# EAGLE design palmquad_v1 (EAGLE 5.11)

## Sheet 1 of 2
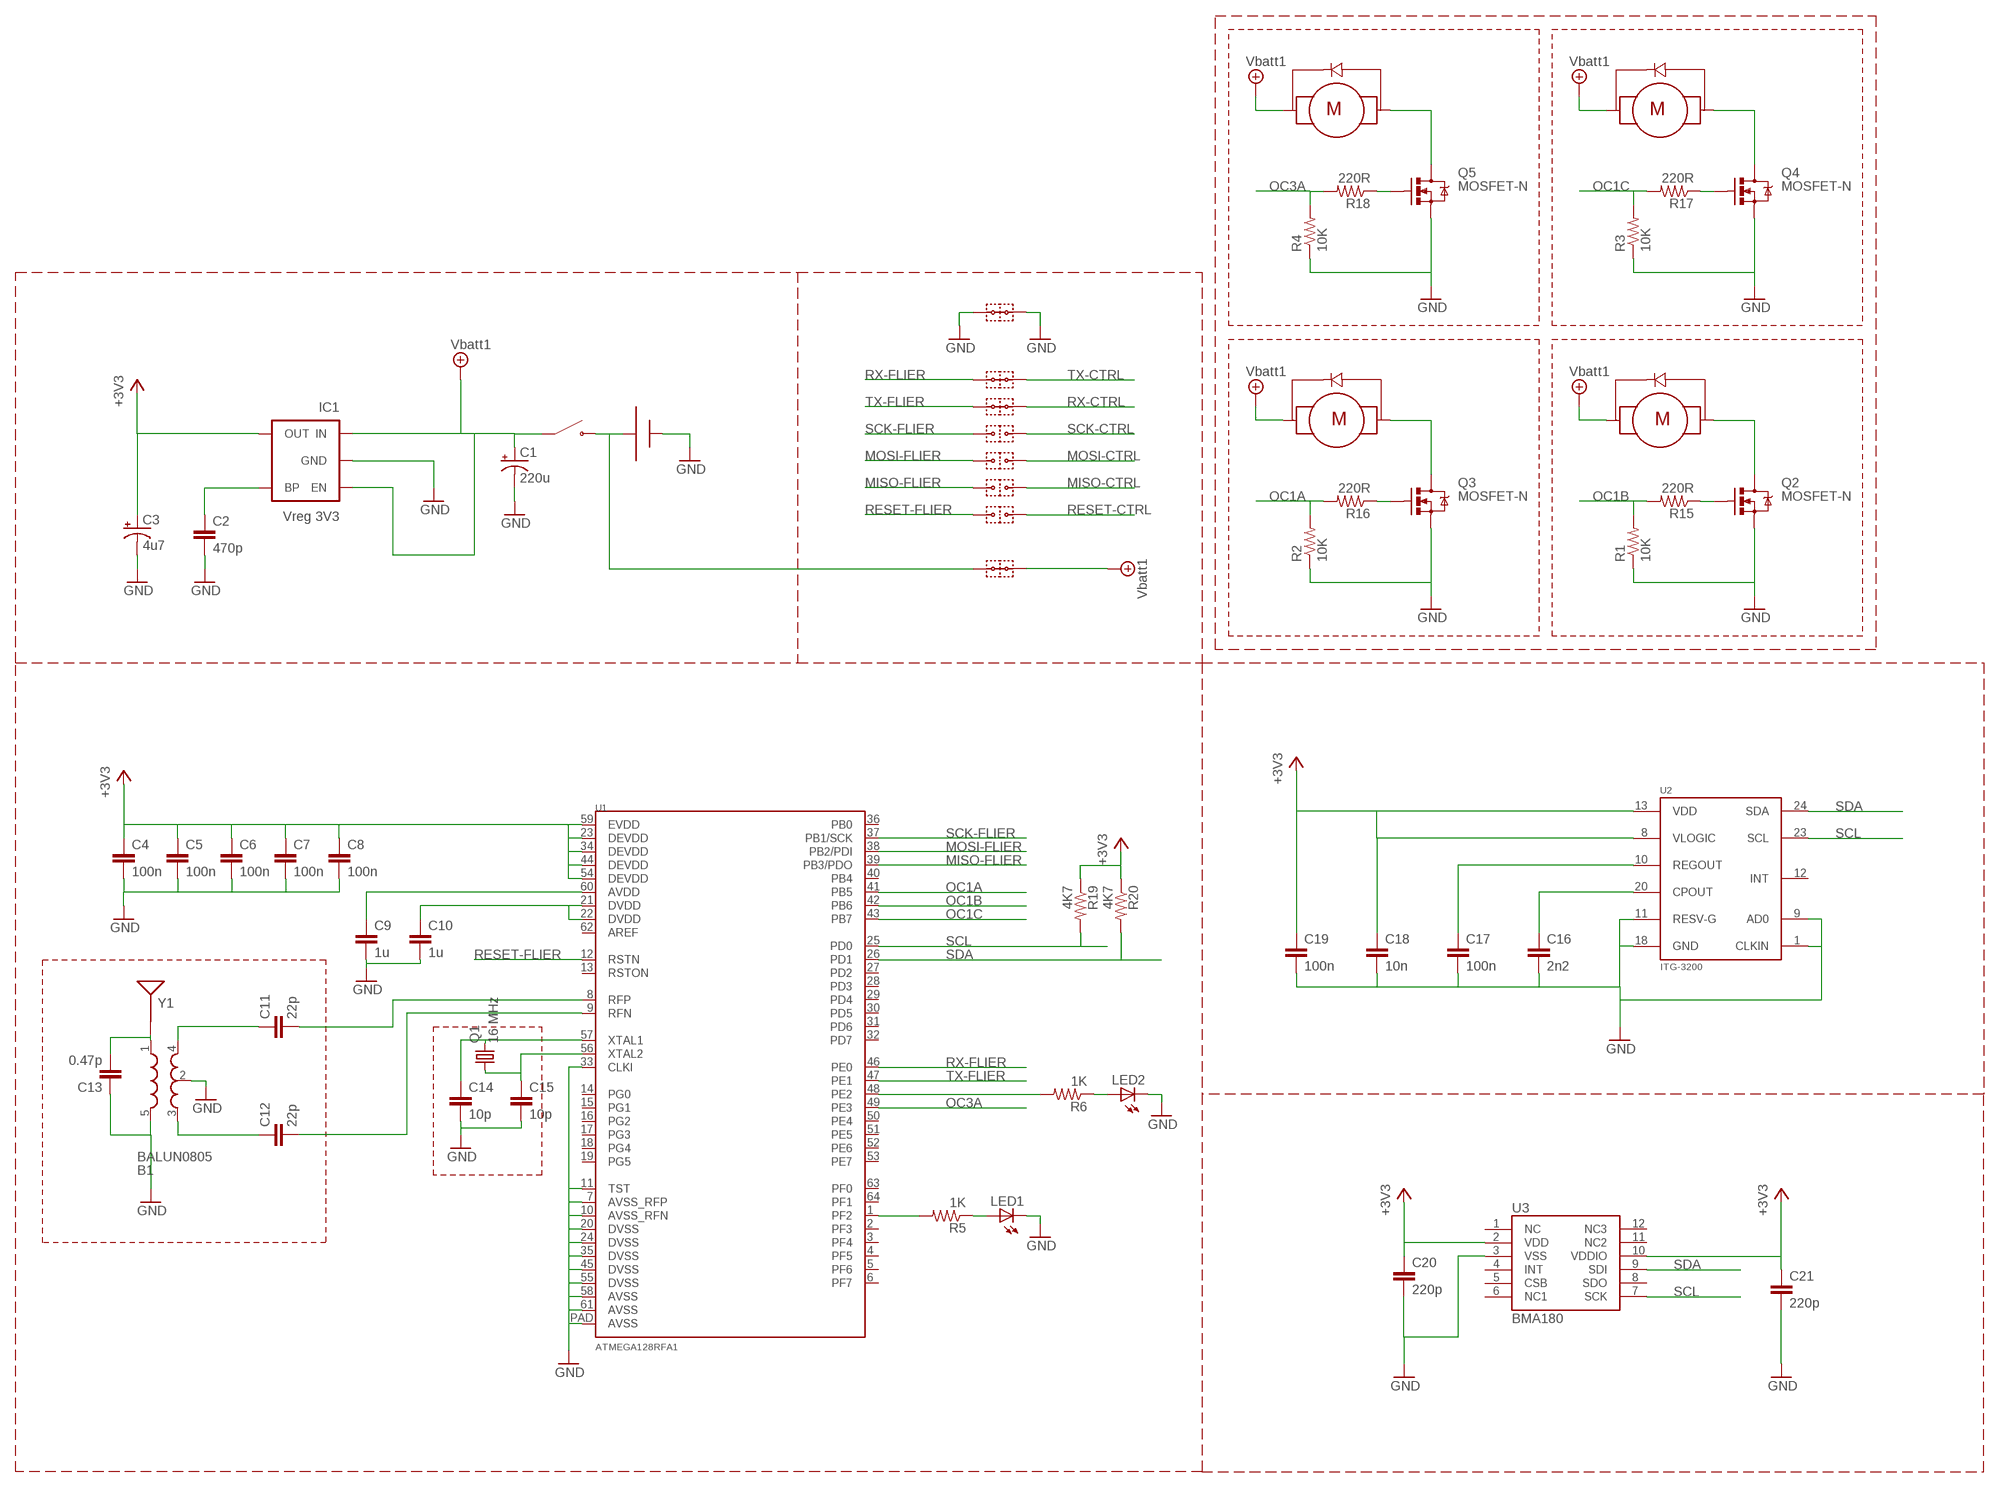
[diagram p0: schematic, sheet 1]

### Parts
B1  BALUN0805  [BALUN]
BATT1  BATT-CONN1  [BATT-CONN-1]
C1  220u  CPOL-USD  [PANASONIC_D]
C2  470p  C-EUC0603  [C0603]
C3  4u7  CPOL-USSMCA  [SMC_A]
C4  100n  C-EUC0603  [C0603]
C5  100n  C-EUC0603  [C0603]
C6  100n  C-EUC0603  [C0603]
C7  100n  C-EUC0603  [C0603]
C8  100n  C-EUC0603  [C0603]
C9  1u  C-EUC0603  [C0603]
C10  1u  C-EUC0603  [C0603]
C11  22p  C-EUC0603  [C0603]
C12  22p  C-EUC0603  [C0603]
C13  0.47p  C-EUC0603  [C0603]
C14  10p  C-EUC0603  [C0603]
C15  10p  C-EUC0603  [C0603]
C16  2n2  C-EUC0603  [C0603]
C17  100n  C-EUC0603  [C0603]
C18  10n  C-EUC0603  [C0603]
C19  100n  C-EUC0603  [C0603]
C20  220p  C-EUC0603  [C0603]
C21  220p  C-EUC0603  [C0603]
IC1  Vreg 3V3  V_REG_LDOSMD  [SOT23-5]
LED1  LEDCHIPLED_0603  [CHIPLED_0603]
LED2  LEDCHIPLED_0603  [CHIPLED_0603]
M1  MOTORARM-CORNER  [MOTOR-CORNER-2]
M2  MOTORARM-CORNER  [MOTOR-CORNER-2]
M3  MOTORARM-CORNER  [MOTOR-CORNER-2]
M4  MOTORARM-CORNER  [MOTOR-CORNER-2]
Q1  16 MHz  CRYSTALCTS406  [CTS406]
Q2  MOSFET-N  MOSFET-NCHANNELSMD  [SOT23-3]
Q3  MOSFET-N  MOSFET-NCHANNELSMD  [SOT23-3]
Q4  MOSFET-N  MOSFET-NCHANNELSMD  [SOT23-3]
Q5  MOSFET-N  MOSFET-NCHANNELSMD  [SOT23-3]
R1  10K  R-US_R0603  [R0603]
R2  10K  R-US_R0603  [R0603]
R3  10K  R-US_R0603  [R0603]
R4  10K  R-US_R0603  [R0603]
R5  1K  R-US_R0603  [R0603]
R6  1K  R-US_R0603  [R0603]
R15  220R  R-US_R0603  [R0603]
R16  220R  R-US_R0603  [R0603]
R17  220R  R-US_R0603  [R0603]
R18  220R  R-US_R0603  [R0603]
R19  4K7  R-US_R0603  [R0603]
R20  4K7  R-US_R0603  [R0603]
S2  SWITCH-PWR-SIMPLE  [SWITCH-PWR]
U1  ATMEGA128RFA1  [QFN-64]
U2  ITG-3200  [QFN-24]
U3  BMA180  [LGA12]
U$1  EDGE-CONN-O-1  [EDGE-CONN-O]
U$2  EDGE-CONN-O-1  [EDGE-CONN-O]
U$3  EDGE-CONN-O-1  [EDGE-CONN-O]
U$4  EDGE-CONN-O-1  [EDGE-CONN-O]
X1  EDGE-CONN-C-1  [EDGE-CONN-C]
X2  EDGE-CONN-C-1  [EDGE-CONN-C]
X5  EDGE-CONN-C-1  [EDGE-CONN-C]
X6  EDGE-CONN-C-1  [EDGE-CONN-C]
Y1  ANTENNA2COMBO1  [ANTENNA-COMBO1]

### Nets
+3V3_FLIER: C3.+ C4.1 C5.1 C6.1 C7.1 C8.1 C18.1 C19.1 C20.1 C21.1 IC1.5(OUT) R19.1 R20.1 U1.23(DEVDD) U1.34(DEVDD) U1.44(DEVDD) U1.54(DEVDD) U1.59(EVDD) U2.8(VLOGIC) U2.13(VDD) U3.2(VDD) U3.10(VDDIO) ; supply symbol labelled +3V3
GND: B1.2(GND) B1.5(GND) BATT1.2 C1.- C2.2 C3.- C4.2 C5.2 C6.2 C7.2 C8.2 C9.2 C10.2 C13.1 C14.2 C15.2 C16.2 C17.2 C18.2 C19.2 C20.2 C21.2 IC1.2(GND) LED1.C LED2.C Q2.2(S) Q3.2(S) Q4.2(S) Q5.2(S) R1.1 R2.1 R3.1 R4.1 U1.7(AVSS_RFP) U1.10(AVSS_RFN) U1.11(TST) U1.20(DVSS) U1.24(DVSS) U1.33(CLKI) U1.35(DVSS) U1.45(DVSS) U1.55(DVSS) U1.58(AVSS) U1.61(AVSS) U1.PAD(AVSS) U2.1(CLKIN) U2.9(AD0) U2.11(RESV-G) U2.18(GND) U3.3(VSS) X6.1 X6.2 ; also sheet 2
MISO-CTRL: U$3.2 ; also sheet 2
MISO-FLIER: U1.39(PB3/PDO) U$3.1
MOSI-CTRL: U$2.2 ; also sheet 2
MOSI-FLIER: U1.38(PB2/PDI) U$2.1
MS1: B1.1(IN) C13.2 Y1.ANT(SIGNAL)
N$1: C2.1 IC1.4(BP)
N$3: C11.2 U1.8(RFP)
N$4: C10.1 U1.21(DVDD) U1.22(DVDD)
N$5: C9.1 U1.60(AVDD)
N$6: B1.3(OUT1) C12.1
N$7: B1.4(OUT2) C11.1
N$8: C12.2 U1.9(RFN)
N$9: C14.1 Q1.3 U1.57(XTAL1)
N$10: C15.1 Q1.1 U1.56(XTAL2)
N$16: C16.1 U2.20(CPOUT)
N$17: C17.1 U2.10(REGOUT)
N$18: M2.B@1 Q3.3(D)
N$19: M3.A@1 Q4.3(D)
N$20: M4.A@1 Q5.3(D)
N$21: M1.B@1 Q2.3(D)
N$23: R5.2 U1.1(PF2)
N$24: LED1.A R5.1
N$40: BATT1.1 S2.P$2 X5.1
N$43: R6.2 U1.48(PE2)
N$44: LED2.A R6.1
N$45: Q5.1(G) R18.1
N$46: Q4.1(G) R17.1
N$47: Q2.1(G) R15.1
N$48: Q3.1(G) R16.1
OC1A: R2.2 R16.2 U1.41(PB5)
OC1B: R1.2 R15.2 U1.42(PB6)
OC1C: R3.2 R17.2 U1.43(PB7)
OC3A: R4.2 R18.2 U1.49(PE3)
RESET-CTRL: U$4.2 ; also sheet 2
RESET-FLIER: U1.12(RSTN) U$4.1
RX-CTRL: X2.2 ; also sheet 2
RX-FLIER: U1.46(PE0) X1.1
SCK-CTRL: U$1.2 ; also sheet 2
SCK-FLIER: U1.37(PB1/SCK) U$1.1
SCL: R19.2 U1.25(PD0) U2.23(SCL) U3.7(SCK)
SDA: R20.2 U1.26(PD1) U2.24(SDA) U3.9(SDI)
TX-CTRL: X1.2 ; also sheet 2
TX-FLIER: U1.47(PE1) X2.1
VBATT-FLIER: C1.+ IC1.1(IN) IC1.3(EN) M1.A@1 M2.A@1 M3.B@1 M4.B@1 S2.P$1 ; supply symbol labelled Vbatt1
VBATT_CHG: X5.2 ; supply symbol labelled Vbatt1 ; also sheet 2
Unconnected: U1.2(PF3) U1.3(PF4) U1.4(PF5) U1.5(PF6) U1.6(PF7) U1.13(RSTON) U1.14(PG0) U1.15(PG1) U1.16(PG2) U1.17(PG3) U1.18(PG4) U1.19(PG5) U1.27(PD2) U1.28(PD3) U1.29(PD4) U1.30(PD5) U1.31(PD6) U1.32(PD7) U1.36(PB0) U1.40(PB4) U1.50(PE4) U1.51(PE5) U1.52(PE6) U1.53(PE7) U1.62(AREF) U1.63(PF0) U1.64(PF1) U2.12(INT) U3.1(NC) U3.4(INT) U3.5(CSB) U3.6(NC1) U3.8(SDO) U3.11(NC2) U3.12(NC3)

## Sheet 2 of 2
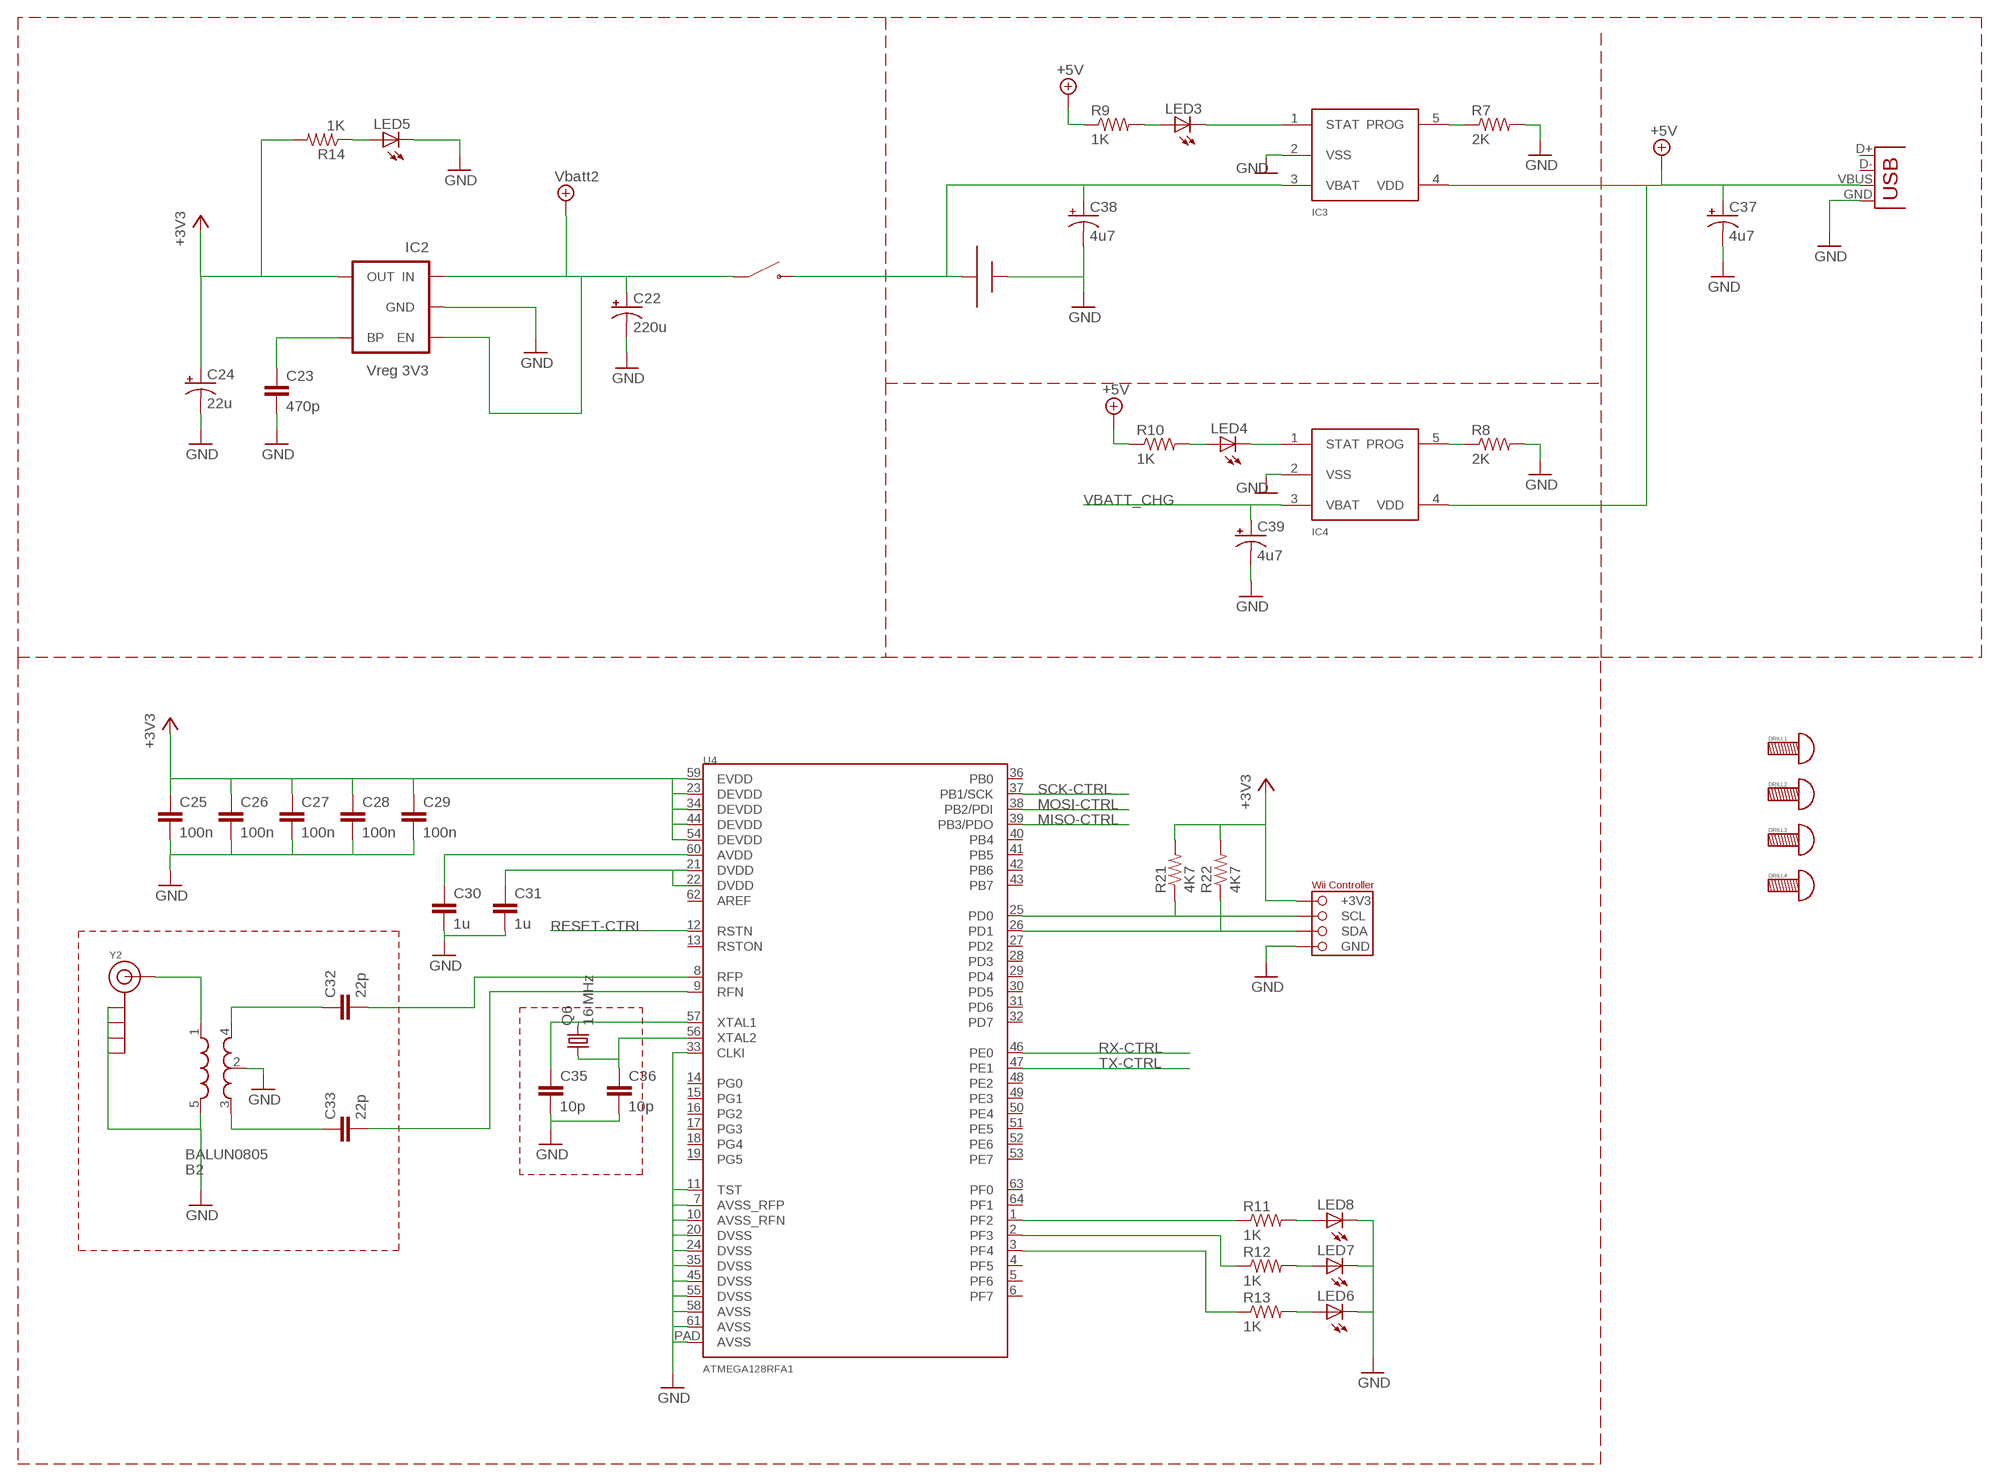
[diagram p1: schematic, sheet 2]

### Parts
B2  BALUN0805  [BALUN]
BATT2  BATT-CONN1  [BATT-CONN-1]
C22  220u  CPOL-USSMCC  [SMC_C]
C23  470p  C-EUC0603  [C0603]
C24  22u  CPOL-USSMCB  [SMC_B]
C25  100n  C-EUC0603  [C0603]
C26  100n  C-EUC0603  [C0603]
C27  100n  C-EUC0603  [C0603]
C28  100n  C-EUC0603  [C0603]
C29  100n  C-EUC0603  [C0603]
C30  1u  C-EUC0603  [C0603]
C31  1u  C-EUC0603  [C0603]
C32  22p  C-EUC0603  [C0603]
C33  22p  C-EUC0603  [C0603]
C35  10p  C-EUC0603  [C0603]
C36  10p  C-EUC0603  [C0603]
C37  4u7  CPOL-USSMCA  [SMC_A]
C38  4u7  CPOL-USSMCA  [SMC_A]
C39  4u7  CPOL-USSMCA  [SMC_A]
DRILL1  HOLE-4-40  [HOLE-4-40]
DRILL2  HOLE-4-40  [HOLE-4-40]
DRILL3  HOLE-4-40  [HOLE-4-40]
DRILL4  HOLE-4-40  [HOLE-4-40]
IC2  Vreg 3V3  V_REG_LDOSMD  [SOT23-5]
IC3  MCP-LI-CHARGER-1  [SOT23-5]
IC4  MCP-LI-CHARGER-1  [SOT23-5]
LED3  LEDCHIPLED_0603  [CHIPLED_0603]
LED4  LEDCHIPLED_0603  [CHIPLED_0603]
LED5  LEDCHIPLED_0603  [CHIPLED_0603]
LED6  LEDCHIPLED_0603  [CHIPLED_0603]
LED7  LEDCHIPLED_0603  [CHIPLED_0603]
LED8  LEDCHIPLED_0603  [CHIPLED_0603]
Q6  16 MHz  CRYSTALCTS406  [CTS406]
R7  2K  R-US_R0603  [R0603]
R8  2K  R-US_R0603  [R0603]
R9  1K  R-US_R0603  [R0603]
R10  1K  R-US_R0603  [R0603]
R11  1K  R-US_R0603  [R0603]
R12  1K  R-US_R0603  [R0603]
R13  1K  R-US_R0603  [R0603]
R14  1K  R-US_R0603  [R0603]
R21  4K7  R-US_R0603  [R0603]
R22  4K7  R-US_R0603  [R0603]
S1  SWITCH-PWR-CNKOS2  [SWITCH-SPDT-CNK-OS2]
U4  ATMEGA128RFA1  [QFN-64]
USB  USBSMD  [USB-MINIB]
X11  WII-CONN  [WII-CONN-2]
Y2  SMA_EDGE  [SMA-EDGE]

### Nets
+3V3_CTRL: C24.+ C25.1 C26.1 C27.1 C28.1 C29.1 IC2.5(OUT) R14.2 R21.2 R22.2 U4.23(DEVDD) U4.34(DEVDD) U4.44(DEVDD) U4.54(DEVDD) U4.59(EVDD) X11.+3V3 ; supply symbol labelled +3V3
GND: B2.2(GND) B2.5(GND) BATT2.2 C22.- C23.2 C24.- C25.2 C26.2 C27.2 C28.2 C29.2 C30.2 C31.2 C35.2 C36.2 C37.- C38.- C39.- IC2.2(GND) IC3.2(VSS) IC4.2(VSS) LED5.C LED6.C LED7.C LED8.C R7.2 R8.2 U4.7(AVSS_RFP) U4.10(AVSS_RFN) U4.11(TST) U4.20(DVSS) U4.24(DVSS) U4.33(CLKI) U4.35(DVSS) U4.45(DVSS) U4.55(DVSS) U4.58(AVSS) U4.61(AVSS) U4.PAD(AVSS) USB.GND X11.GND Y2.GND@0(GND) Y2.GND@1(GND) Y2.GND@2(GND) Y2.GND@3(GND) ; also sheet 1
MISO-CTRL: U4.39(PB3/PDO) ; also sheet 1
MOSI-CTRL: U4.38(PB2/PDI) ; also sheet 1
N$2: LED5.A R14.1
N$11: IC3.5(PROG) R7.1
N$12: LED6.A R13.2
N$13: LED7.A R12.2
N$14: LED8.A R11.2
N$15: IC4.5(PROG) R8.1
N$22: R11.1 U4.1(PF2)
N$25: C23.1 IC2.4(BP)
N$26: C31.1 U4.21(DVDD) U4.22(DVDD)
N$27: C30.1 U4.60(AVDD)
N$28: B2.1(IN) Y2.SIG(SIGNAL)
N$29: B2.3(OUT1) C33.1
N$30: B2.4(OUT2) C32.1
N$31: C32.2 U4.8(RFP)
N$32: C33.2 U4.9(RFN)
N$33: C35.1 Q6.3 U4.57(XTAL1)
N$34: C36.1 Q6.1 U4.56(XTAL2)
N$35: LED3.A R9.2
N$36: IC3.1(STAT) LED3.C
N$37: LED4.A R10.2
N$38: IC4.1(STAT) LED4.C
N$39: BATT2.1 C38.+ IC3.3(VBAT) S1.2
N$41: R12.1 U4.2(PF3)
N$42: R13.1 U4.3(PF4)
RESET-CTRL: U4.12(RSTN) ; also sheet 1
RX-CTRL: U4.46(PE0) ; also sheet 1
SCK-CTRL: U4.37(PB1/SCK) ; also sheet 1
SCL-2: R21.1 U4.25(PD0) X11.SCL
SDA-2: R22.1 U4.26(PD1) X11.SDA
TX-CTRL: U4.47(PE1) ; also sheet 1
VBATT-CTRL: C22.+ IC2.1(IN) IC2.3(EN) S1.1 ; supply symbol labelled Vbatt2
VBATT_CHG: C39.+ IC4.3(VBAT) ; also sheet 1
VUSB: C37.+ IC3.4(VDD) IC4.4(VDD) R9.1 R10.1 USB.VBUS ; supply symbol labelled +5V
Unconnected: U4.4(PF5) U4.5(PF6) U4.6(PF7) U4.13(RSTON) U4.14(PG0) U4.15(PG1) U4.16(PG2) U4.17(PG3) U4.18(PG4) U4.19(PG5) U4.27(PD2) U4.28(PD3) U4.29(PD4) U4.30(PD5) U4.31(PD6) U4.32(PD7) U4.36(PB0) U4.40(PB4) U4.41(PB5) U4.42(PB6) U4.43(PB7) U4.48(PE2) U4.49(PE3) U4.50(PE4) U4.51(PE5) U4.52(PE6) U4.53(PE7) U4.62(AREF) U4.63(PF0) U4.64(PF1) USB.D+ USB.D-

## Library data of the parts
B1 B2 = palmquad_alpha:BALUN
BATT1 BATT2 = palmquad_alpha:BATT-CONN
C1 C3 C22 C24 C37-C39 = rcl:CPOL-US: POLARIZED CAPACITOR, American symbol
C2 C4-C21 C23 C25-C33 C35 C36 = rcl:C-EU: CAPACITOR, European symbol
DRILL1-DRILL4 = palmquad_alpha:HOLE
IC1 IC2 = palmquad_alpha:V_REG_LDO: Voltage Regulator LDO Standard 150mA LDO voltage regulator in SOT-23 layout. Micrel part MIC5205. BP (by-pass) pin is used to lower output noise with 470pF cap.
IC3 IC4 = palmquad_alpha:MCP-LI-CHARGER-1
LED1-LED8 = led:LED: LED OSRAM: - CHIPLED LG R971, LG N971, LY N971, LG Q971, LY Q971, LO R971, LY R971 LH N974, LH R974 LS Q976, LO Q976, LY Q976 LO Q996 - Hyper CHIPLED LW Q18S LB Q993, LB Q99A, LB R99A - SideLED LS A670, LO A670, LY A670, LG A670, LP A670 LB A673, LV A673, LT A673, LW A673 LH A674 LY A675 LS A676, LA A676, LO A676, LY A676, LW A676 LS A679, LY A679, LG A679 - Hyper Micro SIDELED® LS Y876, LA Y876, LO Y876, LY Y876 LT Y87S - SmartLED LW L88C, LW L88S LB L89C, LB L89S, LG L890 LS L89K, LO L89K, LY L89K LS L896, LA L896, LO L896, LY L896 - TOPLED LS T670, LO T670, LY T670, LG T670, LP T670 LSG T670, LSP T670, LSY T670, LOP T670, LYG T670 LG T671, LOG T671, LSG T671 LB T673, LV T673, LT T673, LW T673 LH T674 LS T676, LA T676, LO T676, LY T676, LB T676, LH T676, LSB T676, LW T676 LB T67C, LV T67C, LT T67C, LS T67K, LO T67K, LY T67K, LW E67C LS E67B, LA E67B, LO E67B, LY E67B, LB E67C, LV E67C, LT E67C LW T67C LS T679, LY T679, LG T679 LS T770, LO T770, LY T770, LG T770, LP T770 LB T773, LV T773, LT T773, LW T773 LH T774 LS E675, LA E675, LY E675, LS T675 LS T776, LA T776, LO T776, LY T776, LB T776 LHGB T686 LT T68C, LB T68C - Hyper Mini TOPLED® LB M676 - Mini TOPLED Santana® LG M470 LS M47K, LO M47K, LY M47K Source: http://www.osram.convergy.de LUXEON: - LUMILED® LXK2-PW12-R00, LXK2-PW12-S00, LXK2-PW14-U00, LXK2-PW14-V00 LXK2-PM12-R00, LXK2-PM12-S00, LXK2-PM14-U00 LXK2-PE12-Q00, LXK2-PE12-R00, LXK2-PE12-S00, LXK2-PE14-T00, LXK2-PE14-U00 LXK2-PB12-K00, LXK2-PB12-L00, LXK2-PB12-M00, LXK2-PB14-N00, LXK2-PB14-P00, LXK2-PB14-Q00 LXK2-PR12-L00, LXK2-PR12-M00, LXK2-PR14-Q00, LXK2-PR14-R00 LXK2-PD12-Q00, LXK2-PD12-R00, LXK2-PD12-S00 LXK2-PH12-R00, LXK2-PH12-S00 LXK2-PL12-P00, LXK2-PL12-Q00, LXK2-PL12-R00 Source: www.luxeon.com KINGBRIGHT: KA-3528ASYC Source: www.kingbright.com
M1-M4 = palmquad_alpha:MOTOR
Q1 Q6 = crystal:CRYSTAL: CRYSTAL
Q2-Q5 = palmquad_alpha:MOSFET-NCHANNEL
R1-R22 = rcl:R-US_: RESISTOR, American symbol
S1 S2 = palmquad_alpha:SWITCH-PWR
U1 U4 = palmquad_alpha:ATMEGA128RFA1
U2 = palmquad_alpha:ITG-3200: ITG-3200 3-axis gyro, digital output, qfn24 package
U3 = palmquad_alpha:BMA180
U$1-U$4 = palmquad_alpha:EDGE-CONN-O
USB = palmquad_alpha:USB: USB Connectors USB-B-PTH is fully proven SKU : PRT-00139 USB-miniB is fully proven SKU : PRT-00587 USB-A-PCB is untested. USB-A-H is throughly reviewed, but untested. Spark Fun Electronics SKU : PRT-00437 USB-B-SMT is throughly reviewed, but untested. Needs silkscreen touching up. USB-A-S has not been used/tested USB-MB-H has not been used/tested
X1 X2 X5 X6 = palmquad_alpha:EDGE-CONN-C
X11 = palmquad_alpha:WII-CONN
Y1 = palmquad_alpha:ANTENNA2: Antenna Single endded antenna. Common with smaller chip antennas. CHIP4 package is the GPS Chip Antenna SKU: GPS-08418. CHIP5 package is 2.4GHz chip antenna SKU: WRL-00144.
Y2 = palmquad_alpha:SMA_EDGE: SMA Antenna Connector End launch SMA connector. The paste layer has been removed so that the connector can be hand soldered onto the board after reflow.

## Board
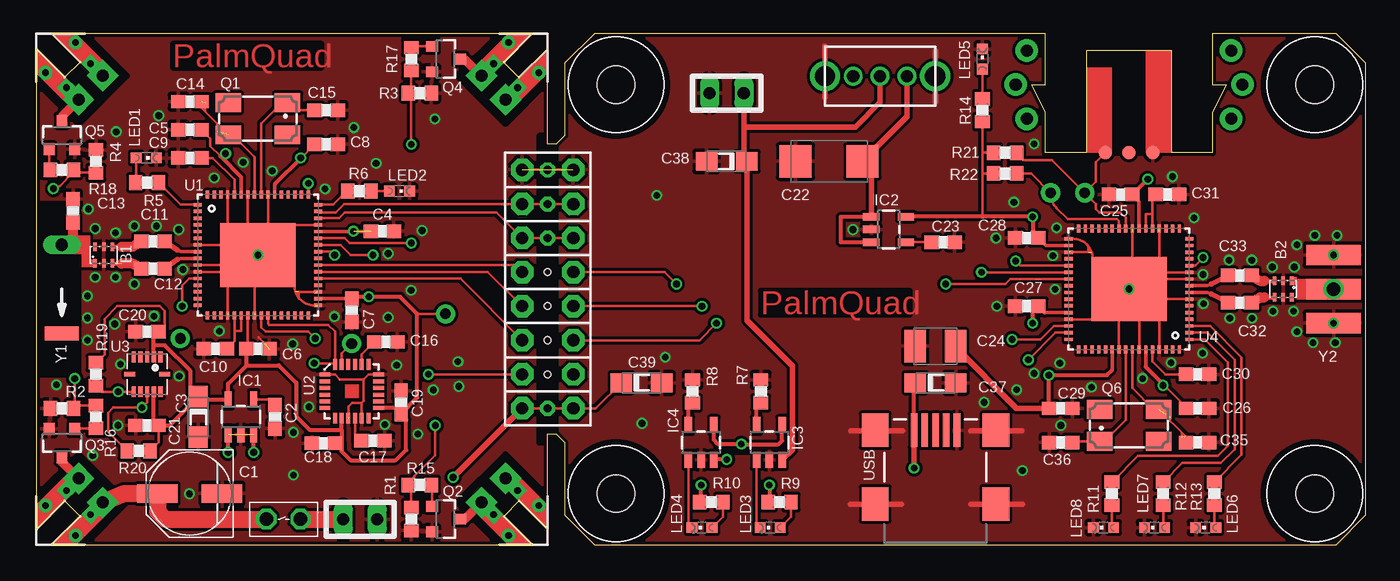
[diagram p2: board, top side]
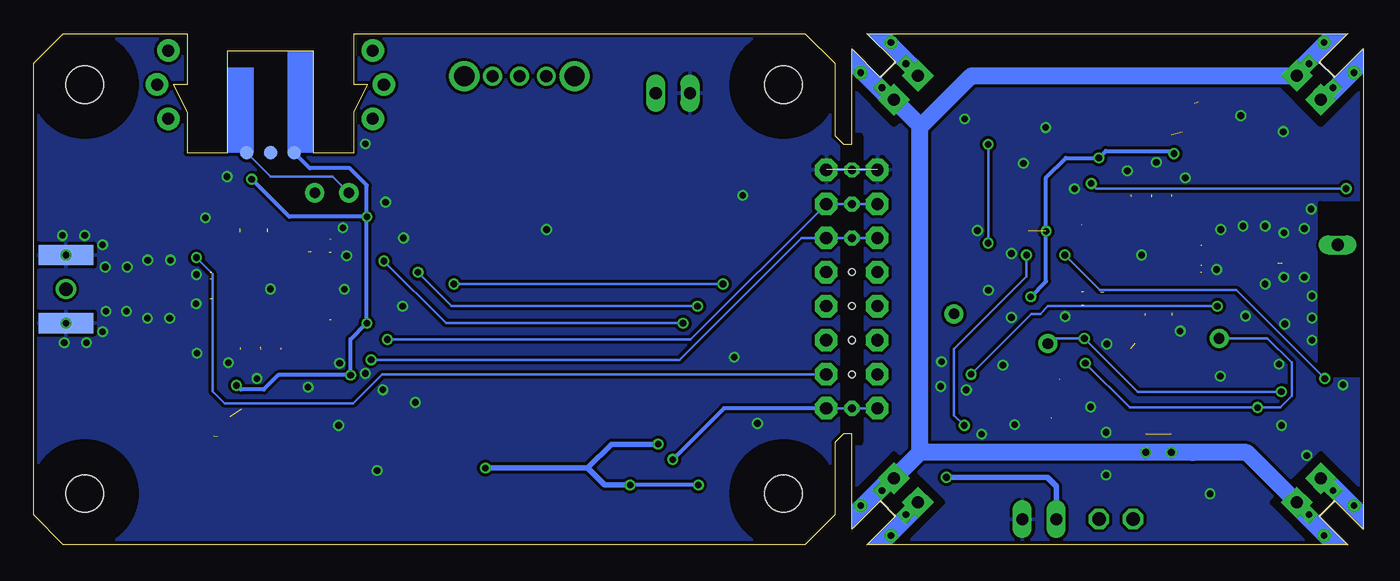
[diagram p3: board, bottom side, seen from below]

Size 99.06 x 38.1 mm. Coordinates in mm from the lower left corner, seen from the top.
Outline: 0,1.14 2.13,3.27 3.27,2.13 1.14,0 36.96,0 34.83,2.13 35.97,3.27 38.1,1.14 38.1,8.26 38.73,8.26 39.37,7.62 39.37,2.22 41.59,0 96.84,0 99.06,2.22 99.06,35.88 96.84,38.1 87.63,38.1 87.63,34.29 88.65,34.29 87.63,32.26 87.63,29.21 84.58,29.21 84.58,36.83 78.23,36.83 78.23,29.21 75.18,29.21 75.18,32.26 74.17,34.29 75.18,34.29 75.18,38.1 41.59,38.1 39.37,35.88 39.37,30.48 38.73,29.84 38.1,29.84 38.1,36.96 36.01,34.86 35.94,34.86 34.86,35.94 34.86,36.01 36.96,38.1 1.14,38.1 3.27,35.97 2.13,34.83 0,36.96 0,1.14
Copper layers (1*16): Top 0.035mm / dielectric 1.5mm / Bottom 0.035mm
Design rules "Fusion_eagle_rule_v1.1_TentedVias3": minimum track width 6mil, minimum drill 0.3mm, track to track 7mil, track to pad 7mil, pad to pad 7mil, via to via 7mil, smd to smd 0mil, copper to edge 10mil, drill to drill 10mil, minimum pad ring 10mil, minimum via ring 6mil, stop-mask expansion 2mil, vias tented up to drill 25mil, thermal gap 10mil
tRestrict: area 0,12.7 to 3.2,25.4; area 37.5,7.6 to 38.7,30.5; area 12.4,17.4 to 20.6,25.7; area 77.3,14.9 to 85.5,23.2; area 7,12 to 9.5,13.4; area 22,10 to 25,12.9; 4 lines
bRestrict: area 0,12.7 to 3.2,25.4; area 37.5,7.6 to 38.7,30.5

### Footprints (pad centres in the part's own frame; a part is rotated, then mirrored left to right if it is on the bottom)
BALUN = smd 0.27 x 0.635: 1 -0.7,-0.616; 2 -0.05,-0.616; 3 0.6,-0.616; 4 0.6,0.616; 5 -0.05,0.616; 6 -0.7,0.616
BATT-CONN-1 = drill 0.9 long: 1 -1.27,0; 2 1.27,0
PANASONIC_D = smd 3 x 1.4: + 2.4,0; - -2.4,0
C0603 = smd 1.1 x 1: 1 -0.85,0; 2 0.85,0
SMC_A = smd 1.6 x 1.4: + -1.5,0; - 1.5,0
SMC_C = smd 2.4 x 2.4: + -2.5,0; - 2.5,0
SMC_B = smd 1.6 x 2.4: + -1.5,0; - 1.5,0
HOLE-4-40 = hole 2.794: 0,0
SOT23-5 = smd 0.55 x 1.2: 1 -0.95,-1.3; 2 0,-1.3; 3 0.95,-1.3; 4 0.95,1.3; 5 -0.95,1.3
CHIPLED_0603 = smd 0.8 x 0.8: A 0,-0.75; C 0,0.75
MOTOR-CORNER-2 = drill 0.9 pad 1.676 square: A@1 -1.27,-5.715; B@1 1.27,-5.715 | drill 0.5 square: A@2 -1.27,-4.445; B@2 1.27,-4.445 | drill 0.5 round: P$1 -1.587,-2.54; P$2 1.587,-2.54
CTS406 = smd 1.9 x 1.4: 1 -2.2,-1.2; 2 2.2,-1.2; 3 2.2,1.2; 4 -2.2,1.2
SOT23-3 = smd 0.8 x 0.9: 1 -0.95,-1; 2 0.95,-1; 3 0,1.1
R0603 = smd 1 x 1.1: 1 -0.85,0; 2 0.85,0
SWITCH-SPDT-CNK-OS2 = drill 0.9 round: 1 0,2.007; 2 0,0; 3 0,-2.007 | drill 1.499 pad 1.905 round: P$4 0,4.102; P$5 0,-4.102
SWITCH-PWR = drill 1 octagon: P$1 -1.27,0; P$2 1.27,0
QFN-64 = smd 0.6 x 0.25: 1 -4.5,3.75; 2 -4.5,3.25; 3 -4.5,2.75; 4 -4.5,2.25; 5 -4.5,1.75; 6 -4.5,1.25; 7 -4.5,0.75; 8 -4.5,0.25; 9 -4.5,-0.25; 10 -4.5,-0.75; 11 -4.5,-1.25; 12 -4.5,-1.75; 13 -4.5,-2.25; 14 -4.5,-2.75; 15 -4.5,-3.25; 16 -4.5,-3.75; 33 4.5,-3.75; 34 4.5,-3.25; 35 4.5,-2.75; 36 4.5,-2.25; 37 4.5,-1.75; 38 4.5,-1.25; 39 4.5,-0.75; 40 4.5,-0.25; 41 4.5,0.25; 42 4.5,0.75; 43 4.5,1.25; 44 4.5,1.75; 45 4.5,2.25; 46 4.5,2.75; 47 4.5,3.25; 48 4.5,3.75 | smd 0.25 x 0.6: 17 -3.75,-4.5; 18 -3.25,-4.5; 19 -2.75,-4.5; 20 -2.25,-4.5; 21 -1.75,-4.5; 22 -1.25,-4.5; 23 -0.75,-4.5; 24 -0.25,-4.5; 25 0.25,-4.5; 26 0.75,-4.5; 27 1.25,-4.5; 28 1.75,-4.5; 29 2.25,-4.5; 30 2.75,-4.5; 31 3.25,-4.5; 32 3.75,-4.5; 49 3.75,4.5; 50 3.25,4.5; 51 2.75,4.5; 52 2.25,4.5; 53 1.75,4.5; 54 1.25,4.5; 55 0.75,4.5; 56 0.25,4.5; 57 -0.25,4.5; 58 -0.75,4.5; 59 -1.25,4.5; 60 -1.75,4.5; 61 -2.25,4.5; 62 -2.75,4.5; 63 -3.25,4.5; 64 -3.75,4.5 | smd 5.639 x 4.75: PAD 0,0
QFN-24 = smd 0.8 x 0.3: 1 -2,1.25; 2 -2,0.75; 3 -2,0.25; 4 -2,-0.25; 5 -2,-0.75; 6 -2,-1.25; 13 2,-1.25; 14 2,-0.75; 15 2,-0.25; 16 2,0.25; 17 2,0.75; 18 2,1.25 | smd 0.3 x 0.8: 7 -1.25,-2; 8 -0.75,-2; 9 -0.25,-2; 10 0.25,-2; 11 0.75,-2; 12 1.25,-2; 19 1.25,2; 20 0.75,2; 21 0.25,2; 22 -0.25,2; 23 -0.75,2; 24 -1.25,2
LGA12 = smd 0.8 x 0.32: 1 -1.3,1; 2 -1.3,0.5; 3 -1.3,0; 4 -1.3,-0.5; 5 -1.3,-1; 7 1.3,-1; 8 1.3,-0.5; 9 1.3,0; 10 1.3,0.5; 11 1.3,1 | smd 0.32 x 0.8: 6 0,-1.3; 12 0,1.3
EDGE-CONN-O = drill 0.9 pad 1.676 octagon: 1 -1.905,0; 2 1.905,0 | hole 0.5: 0,0
USB-MINIB = smd 2.5 x 0.5: D+ 2.5,0; D- 2.5,0.8; GND 2.5,-1.6; ID 2.5,-0.8; VBUS 2.5,1.6 | smd 2.5 x 2: GND@1 -3,-4.5; GND@2 -3,4.5; GND@3 2.5,4.5; GND@4 2.5,-4.5
EDGE-CONN-C = drill 0.9 pad 1.676 octagon: 1 -1.905,0; 2 1.905,0 | drill 0.6 octagon: C 0,0
WII-CONN-2 = smd 1.016 x 1.016 bottom: +3V3 1.778,7.62; DEV_DET 0,7.62; SDA -1.778,7.62 | smd 1.016 x 1.016: GND -1.778,7.62; NC 0,7.62; SCL 1.778,7.62 | drill 0.9 pad 1.676 round: P$4 -7.62,0; P$5 7.62,0; P$6 -7.62,5.08; P$7 7.62,5.08; P$11 -8.445,2.54; P$12 8.445,2.54
ANTENNA-COMBO1 = drill 0.9 long: ANT 3.302,0 | smd 1.016 x 2.54: NC -3.302,0
SMA-EDGE = smd 1.524 x 4.064: GND@0 0,0; GND@1 5.08,0; SIG 2.54,0 | smd 1.524 x 4.064 bottom: GND@2 0,0; GND@3 5.08,0

### Placement (x,y rotation side)
B1  5.08,21.59 0 top
B2  92.84,19.05 180 top
BATT1  24.13,1.91 0 top
BATT2  51.44,33.66 180 top
C1  11.43,3.81 180 top
C2  17.78,9.53 270 top
C3  12.06,9.53 270 top
C4  25.78,23.37 0 top
C5  11.43,30.92 180 top
C6  16.51,14.61 0 top
C7  23.5,17.46 270 top
C8  21.59,29.84 0 top
C9  11.43,28.83 180 top
C10  13.34,14.61 180 top
C11  8.7,22.61 0 top
C12  8.7,20.57 0 top
C13  2.73,24.89 270 top
C14  11.43,33.02 180 top
C15  21.59,32.38 0 top
C16  26.04,15.11 0 top
C17  25.08,7.75 0 top
C18  21.4,7.56 180 top
C19  27.18,10.6 90 top
C20  8.26,15.88 180 top
C21  8.26,8.89 180 top
C22  59.05,28.57 180 top
C23  67.56,22.55 0 top
C24  66.99,14.8 180 top
C25  80.77,26.1 180 top
C26  86.51,10.16 0 top
C27  73.79,17.78 180 top
C28  73.79,22.86 180 top
C29  76.33,10.16 0 top
C30  86.51,12.7 0 top
C31  84.26,26.1 0 top
C32  89.66,18.03 180 top
C33  89.66,20.07 180 top
C35  86.51,7.62 0 top
C36  76.33,7.62 180 top
C37  66.99,12.06 0 top
C38  51.44,28.57 180 top
C39  45.09,12.06 0 top
DRILL1  43.18,3.81 0 top
DRILL2  95.25,3.81 0 top
DRILL3  43.18,34.29 0 top
DRILL4  95.25,34.29 0 top
IC1  15.24,9.53 0 top
IC2  63.5,23.5 270 top
IC3  54.61,7.62 0 top
IC4  49.53,7.62 0 top
LED1  8.19,28.83 270 top
LED2  27.05,26.35 270 top
LED3  54.67,1.27 90 top
LED4  49.59,1.27 90 top
LED5  70.48,36.2 0 top
LED6  87.12,1.27 90 top
LED7  83.31,1.27 90 top
LED8  79.5,1.27 90 top
M1  38.1,0 225 top
M2  0,0 135 top
M3  38.1,38.1 315 top
M4  0,38.1 45 top
Q1  16.51,31.75 180 top
Q2  30.48,1.91 270 top
Q3  1.91,7.62 180 top
Q4  30.48,36.2 270 top
Q5  1.91,30.48 0 top
Q6  81.41,8.89 0 top
R1  27.94,1.91 90 top
R2  1.91,10.16 0 top
R3  28.57,33.66 180 top
R4  4.45,28.57 270 top
R5  8.26,26.99 0 top
R6  24.07,26.35 180 top
R7  53.98,11.43 90 top
R8  48.9,11.43 90 top
R9  55.37,3.17 0 top
R10  50.29,3.17 0 top
R11  80.14,3.81 270 top
R12  83.95,3.81 270 top
R13  87.76,3.81 270 top
R14  70.48,32.38 270 top
R15  28.57,4.45 180 top
R16  4.45,9.53 90 top
R17  27.94,36.2 270 top
R18  1.91,27.94 0 top
R19  4.45,12.7 270 top
R20  7.62,6.99 180 top
R21  72.17,29.21 180 top
R22  72.17,27.67 180 top
S1  62.87,34.92 270 top
S2  18.41,1.91 0 top
U1  16.51,21.59 0 top
U2  23.5,11.43 0 top
U3  8.26,12.7 270 top
U4  81.41,19.05 180 top
U$1  38.1,15.24 0 top
U$2  38.1,17.78 0 top
U$3  38.1,20.32 0 top
U$4  38.1,12.7 0 top
U$5  [ARM-MOCK]  35.56,35.56 45 top
U$6  [ARM-MOCK]  2.54,35.56 135 top
U$7  [ARM-MOCK]  2.54,2.54 225 top
U$8  [ARM-MOCK]  35.56,2.54 315 top
USB  66.99,6.03 90 top
X1  38.1,22.86 0 top
X2  38.1,25.4 0 top
X5  38.1,10.16 0 top
X6  38.1,27.94 180 top
X11  81.41,36.83 180 top
Y1  1.91,19.05 90 top
Y2  96.65,16.51 90 top

### Tracks (layer width: path | path; a pad name or v marks a point on that pad's centre or on a via)
+3V3_CTRL  (via drill 0.5)
  Top 0.203: C29.1 75.45,10.19 | C29.1 75.48,10.23 | C26.1 85.64,10.27 83.89,12.01 83.69,12.01 | C25.1 81.62,25.82 | C29.1 75.44,10.16 | 74.23,17.38 C27.1 | 70.48,24.45 70.48,27.67 | 70.48,29.21 R14.2 | 70.48,29.21 R21.2 | 70.48,27.67 R22.2 | 70.48,27.67 70.48,29.21
  Top 0.254: U4.34 75.2,22.3 C28.1 | 75.12,17.3 U4.44 | 80.16,13.03 U4.54 | 82.66,13.25 U4.59 | U4.23 82.16,25.56 C25.1
  Top 0.305: C27.1 75.12,17.3 | 82.66,13.25 83.89,12.01 83.95,11.96 v83.95,11.87 | 80.16,13.03 79.76,12.64 v75.44,12.64 75.44,10.16 | v74.23,16.51 74.23,17.38 | v82.8,27.24 81.66,26.1 C25.1 | C28.1 74.23,23.27 v74.23,24.45 70.48,24.45 IC2.5
  Top 0.406: C24.+ 68.39,14.8 73.03,10.16 C29.1
  Bottom 0.305: X11.+3V3 78.49,28.07 75.5,28.07 74.23,26.8 v74.23,24.45 | v83.95,11.87 83.63,11.56 81.92,11.56 80.83,12.64 v75.44,12.64 75.44,15.3 v74.23,16.51 v74.23,24.45 | v74.23,24.45 80.01,24.45 v82.8,27.24
+3V3_FLIER  (via drill 0.5, 0.8 pad 1.42)  (1 unrouted)
  Top 0.203: 8.76,16.16 C20.1 9.11,16.22 9.55,16.22 9.55,17.43 9.2,17.78 6.03,17.78 5.08,16.84 5.08,14.19 R19.1 | 8.76,9.24 C21.1 9.11,7.62 R20.1 | C5.1 12.95,30.25 12.95,29.72 13.72,28.96 | 23.5,18.34 C7.1 23.66,18.48 | U1.23 15.76,14.61 C6.1 | 22.75,7.68 C18.1 | 26.75,10.18 C19.1 27.18,9.34 27.56,9.34 | 11.63,10.82 C3.+ 11.49,11.03 | 24.93,23.34 C4.1 | v19.68,28.83 19.72,28.83 C8.1 | 28.38,17.21 v30.48,17.21
  Top 0.254: 17.76,26.86 U1.54 | 15.26,27.41 U1.59 | 23.5,18.34 U1.34 | 8.76,14.86 U3.2 | U1.44 24.93,23.34
  Top 0.279: U3.2 8.76,16.16 | 8.76,9.24 U3.10 | 26.75,10.18 U2.13 | U2.8 22.75,8.57 22.75,7.68
  Top 0.305: 19.72,28.83 17.76,26.86 | 15.26,27.41 13.72,28.96 13.91,29.15 v14.1,29.15 | 22.75,7.68 22.75,6.96 23.42,6.29 26.78,6.29 27.56,7.06 27.56,9.34 | 11.63,10.82 IC1.5 14.29,11.99 15.66,13.36 | 11.49,11.03 11.49,12.94 9.57,14.86 8.76,14.86 | C21.1 9.93,8.89 C3.+ | 15.66,13.36 C6.1 | 15.66,13.36 18.07,13.36 19.37,12.06 19.37,9.58 20.37,8.57 22.75,8.57 | 23.66,18.48 v24.77,18.48 27.11,18.48 28.38,17.21 28.38,10.96 C19.1
  Bottom 0.203: v23.62,23.37 23.59,23.34 | v24.77,18.48 24.83,18.48
  Bottom 0.305: v14.1,29.15 14.29,29.34 19.18,29.34 v19.68,28.83 22.16,28.83 23.62,27.37 v23.62,23.37 23.62,19.62 v24.77,18.48
GND  (via drill 0.5)  (28 unrouted)
  Top 0.203: 17.02,14.99 16.57,15.43 | 14.26,17.27 14.26,19.46 | 16.26,17.23 16.26,19.41 | 18.77,23.84 20.96,23.84 | 17.27,23.77 17.27,25.95 | 15.76,23.72 15.76,25.91 | 14.26,23.75 14.26,25.93 | 12.09,20.84 14.27,20.84 | 12.14,20.34 14.33,20.34 | 12.11,22.34 14.3,22.34 | 20.8,17.83 20.73,17.83 arc-90 19.23,19.33 | 83.62,20.29 85.8,20.29 | 83.61,19.8 85.8,19.8 | 83.58,18.3 85.76,18.3 | 83.66,14.72 83.66,16.9 | 82.16,14.73 82.16,16.92 | 80.66,14.67 80.66,16.86 | 77,16.8 79.19,16.8 | 81.66,21.13 81.66,23.32 | 83.66,21.11 83.66,23.29 | 19.33,18.84 20.82,18.84 | 77.02,22.8 77.23,22.8 arc-90 78.69,21.34 | 78.61,21.8 77.06,21.8 | 24.24,10.57 24.24,9.58 | 24.24,10.57 24.38,10.71 24.38,12.32 | 24.38,12.32 22.62,12.32 | 23.25,9.5 23.25,10.3 23.52,10.57 24.24,10.57 | 25.3,12.69 24.75,12.69 24.38,12.32 | 21.69,12.68 22.25,12.68 22.61,12.32 | 19.56,18.4 19.56,18.83 | 78.37,21.82 78.37,22.24
  Top 0.406: 60.71,8.47 64.52,8.47 | 69.62,8.5 73.43,8.5 | 69.65,3.02 73.46,3.02 | 60.64,3.01 64.45,3.01 | 58.75,33.34 58.75,37.15 | 66.97,32.99 66.97,36.8
  other vias: 96.65,21.59 96.65,16.51 93.66,17.4 93.92,15.88 92.08,20.7 93.92,22.35 92.14,17.4 90.55,21.21 95.25,23.05 96.9,23.05 95.12,15.05 96.77,15.05 5.91,23.24 3.87,25.02 5.91,19.94 4.38,19.94 4.38,23.56 10.91,20.51 86.93,20.14 86.95,17.95 45.13,9.04 15.41,28.49 17.57,27.86 13.25,27.35 9.12,31.98 25.97,8.95 7.3,23.75 7.3,19.43 5.95,30.78 29.7,31.73 23.66,31.1 28.43,8.24 26.84,13.38 20.3,10.27 19.16,8.36 10.65,12.55 1.5,11.92 11.41,3.79 22.2,17 13.63,15.92 84.65,27.43 76.01,23.62 71.5,22.86 71.56,17.78 82.42,12.38 76.33,8.89 76.26,13.53 26.2,16.94 27.92,18.97 31.41,13.63 31.48,11.79 29.57,11.54 8.77,17.04 5.85,16.45 88.92,16.87 90.57,16.87 88.86,21.21 60.83,23.5 19.09,14.97 86.89,14.27 28.74,23.41 26.2,21.7 21.51,26.52 46.86,13.97 46.23,26.04 93.73,20.7 3.81,18.54 3.81,16.89 84.54,13.57 75.9,19.03 86.25,24.37 75.74,21.54 19.16,5.19 4.21,6.65 74.35,12.76 70.61,10.6 78.61,11.75 72.83,25.53 25.32,28.43 16.51,21.59 81.41,19.05 8.95,23.75 10.6,23.5 6.27,13.46 73.47,5.52 6.09,8.89 3.81,15.24 74.33,29.87 73.04,11.54
  pour Top (isolate 0.216): -0.32,38.42 38.1,38.42 38.1,29.21 39.37,30.48 39.37,38.42 99.38,38.42 99.38,-0.32 39.37,-0.32 39.37,7.62 38.1,8.89 38.1,-0.32 -0.32,-0.32
  pour Bottom (isolate 0.216): -0.32,38.42 38.1,38.42 38.1,29.21 39.37,30.48 39.37,38.42 99.38,38.42 99.38,-0.32 39.37,-0.32 39.37,7.62 38.1,8.89 38.1,-0.32 -0.32,-0.32
MISO-CTRL  (via drill 0.5)
  Top 0.203: U4.39 72.57,19.8 72.2,19.43 v67.75,19.43 | v47.69,19.43 46.8,20.32 U$3.2
  Bottom 0.203: v47.69,19.43 v67.75,19.43
MISO-FLIER
  Top 0.203: U1.39 35.67,20.84 U$3.1
MOSI-CTRL  (via drill 0.5)
  Top 0.203: v70.42,20.3 U4.38 | U$2.2 v49.59,17.78
  Bottom 0.203: v49.59,17.78 67.9,17.78 v70.42,20.3
MOSI-FLIER
  Top 0.203: U1.38 33.63,20.34 U$2.1
MS1
  Top 0.203: 2.73,22.35 2.98,22.35 3.68,21.65 3.68,20.97 B1.1
  Top 0.762: C13.2 2.73,22.35 Y1.ANT
N$1
  Top 0.203: IC1.4 17.33,10.82 C2.1
N$2
  Top 0.203: LED5.A R14.1
N$3
  Top 0.254: U1.8 10.75,21.84 10.5,21.97
  Top 0.406: C11.2 10.5,21.97
N$4
  Top 0.203: C10.1 14.76,15.18 14.76,15.94 | 14.76,15.94 U1.21 | U1.22 15.26,15.94 14.76,15.94
N$5
  Top 0.203: C9.1 13.16,28.83 14.76,27.23 U1.60
N$6  (1 unrouted)
  Top 0.305: B1.3 6.01,20.97
  Top 0.762: 6.35,20.95 7.21,20.95 C12.1
N$7
  Top 0.305: B1.4 6.33,22.21
  Top 0.762: 6.33,22.21 7.2,22.21 C11.1
N$8
  Top 0.254: 10.5,21.24 10.75,21.34 U1.9
  Top 0.406: C12.2 10.5,21.24
N$9  (2 unrouted)
  Top 0.203: U1.57 16.26,28.89 14.6,30.55 Q1.3 12.28,32.58 C14.1 | 13.46,31.39 13.46,30.78 | 12.57,32.91 12.57,32.31
N$10
  Top 0.203: U1.56 16.76,31.39 18.32,32.95 Q1.1 arc90 19.27,32.38 C15.1
N$11
  Top 0.305: IC3.5 53.66,10.58 R7.1
N$12
  Top 0.203: R13.2 87.76,1.39 LED6.A
N$13
  Top 0.203: R12.2 83.95,1.39 LED7.A
N$14
  Top 0.203: R11.2 80.14,1.39 LED8.A
N$15
  Top 0.305: IC4.5 48.58,10.58 R8.1
N$16
  Top 0.203: U2.20 24.25,14.17 C16.1
N$17
  Top 0.203: U2.10 23.75,7.68 C17.1
N$18
  Top 0.635: Q3.3 1.91,6.18 M2.B@1
N$19
  Top 0.635: Q4.3 31.92,36.2 M3.A@1
N$20
  Top 0.635: Q5.3 1.91,31.92 M4.A@1
N$21
  Top 0.635: Q2.3 31.92,1.91 M1.B@1
N$22
  Top 0.203: U4.1 87.06,15.3 88.77,13.59 88.77,7.37 88.01,6.6 82.08,6.6 R11.1
N$23
  Top 0.203: U1.1 10.75,25.34 R5.2
N$24
  Top 0.203: LED1.A 7.44,27.02 R5.1
N$25
  Top 0.203: IC2.4 C23.1
N$26
  Top 0.203: U4.21 83.16,24.64 | 83.16,24.64 83.16,25.72 C31.1 | U4.22 82.66,24.64 83.16,24.64
N$27
  Top 0.203: U4.60 83.16,13.66 84.12,12.7 C30.1
N$28  (via drill 1)
  Top 0.203: 96.15,19.55 Y2.SIG 96.03,19.67 B2.1
  other vias: 96.65,19.05
N$29
  Top 0.305: 91.52,19.67 B2.3
  Top 0.762: 91.52,19.67 91.17,19.67 C33.1
N$30
  Top 0.305: 91.52,18.43 B2.4
  Top 0.762: 91.52,18.43 91.17,18.43 C32.1
N$31
  Top 0.254: U4.8 87.24,18.8 87.53,18.68
  Top 0.406: 87.53,18.68 C32.2
N$32
  Top 0.254: U4.9 87.24,19.3 87.53,19.42
  Top 0.406: 87.53,19.42 C33.2
N$33  (2 unrouted)
  Top 0.203: U4.57 81.66,11.67 83.24,10.09 Q6.3 85.64,8.06 C35.1 | 84.45,9.27 84.45,9.53 | 85.34,8.03 85.34,8.33
N$34
  Top 0.203: U4.56 81.16,9.29 79.56,7.69 Q6.1 77.25,7.69 C36.1
N$35
  Top 0.203: LED3.A 56.22,2.07 R9.2
N$36
  Top 0.203: IC3.1 53.66,1.27 LED3.C
N$37
  Top 0.203: LED4.A 51.14,2.07 R10.2
N$38
  Top 0.203: IC4.1 48.58,1.6 LED4.C
N$39
  Top 0.406: IC3.3 56.33,7.08 56.33,13.34 52.94,16.73 C38.+ 52.7,28.8 BATT2.1 52.7,31.11 61.01,31.11 62.87,32.97 S1.2
N$40  (via drill 0.5)
  Top 0.406: v31.05,5.02 X5.1
  Top 1.27: S2.P$2 BATT1.1
  Bottom 0.406: BATT1.1 22.86,4.35 23.53,5.02 v31.05,5.02
N$41
  Top 0.203: U4.2 87.26,15.8 89.28,13.78 89.28,7.11 88.27,6.1 85.38,6.1 R12.1
N$42
  Top 0.203: U4.3 87.46,16.3 89.79,13.97 89.79,6.69 R13.1
N$43
  Top 0.203: U1.48 22.13,25.34 22.76,25.97 22.84,25.97 R6.2
N$44
  Top 0.203: R6.1 LED2.A
N$45
  Top 0.203: R18.1 0.95,28.04 Q5.1
N$46
  Top 0.203: R17.1 28.04,37.15 Q4.1
N$47
  Top 0.203: R15.1 arc-90 29.48,4.39 Q2.1
N$48
  Top 0.203: Q3.1 2.91,8.68 R16.1
OC1A  (via drill 0.5)
  Top 0.203: U1.41 21.98,21.84 v22.23,21.59 | v2.86,12.38 2.86,10.26 R2.2 2.97,10.38 R16.2
  Bottom 0.203: v2.86,12.38 9.46,18.99 19.62,18.99 v22.23,21.59
OC1B  (via drill 0.5)
  Top 0.203: U1.42 22.68,22.34 23.43,21.59 v25.08,21.59 | v29.72,8.89 29.72,6.67 28.17,5.12 28,4.72 R15.2 27.94,4.23 R1.2
  Bottom 0.203: v25.08,21.59 25.08,20 30.48,14.61 30.48,9.65 v29.72,8.89
OC1C  (via drill 0.5)
  Top 0.203: U1.43 22.99,22.84 23.35,22.48 v27.94,22.48 | v27.94,29.84 27.94,33.66 | 27.94,33.66 R17.2 | 27.94,33.66 R3.2
  Bottom 0.203: v27.94,22.48 v27.94,29.84
OC3A  (via drill 0.5)
  Top 0.203: v20.26,26.92 U1.49 | v1.27,26.54 1.73,26.73 2.75,27.76 R18.2 2.75,27.73 R4.2
  Bottom 0.203: v1.27,26.54 19.88,26.54 v20.26,26.92
RESET-CTRL  (via drill 0.5)
  Top 0.203: U4.12 86.33,20.8 v86.93,21.4
  Bottom 0.203: U$4.2 73.09,12.7 75.25,10.54 84.84,10.54 85.72,11.43 85.72,20.19 v86.93,21.4
RESET-FLIER  (via drill 0.5)
  Top 0.203: U1.12 11.38,19.84 10.86,19.31 v10.86,17.78 | v29.21,12.7 U$4.1
  Bottom 0.203: v10.86,17.78 23.5,17.78 24.07,17.21 24.7,17.21 v29.21,12.7
RX-CTRL  (via drill 0.5)
  Top 0.203: U4.46 75.8,16.3 74.8,15.3 v72.71,15.3
  Bottom 0.203: v72.71,15.3 50.1,15.3 X2.2
RX-FLIER
  Top 0.203: U1.46 22.56,24.34 22.99,24.77 34.29,24.77 X1.1
SCK-CTRL  (via drill 0.5)
  Top 0.203: v50.67,16.51 49.4,15.24 U$1.2 | U4.37 73.31,20.8 v72.96,21.14
  Bottom 0.203: v50.67,16.51 68.33,16.51 v72.96,21.14
SCK-FLIER
  Top 0.203: U1.37 31.59,19.84 U$1.1
SCL  (via drill 0.5, 0.8 pad 1.42)
  Top 0.203: U1.25 16.76,16.2 17.09,15.88 20.26,15.88 v20.77,15.37 | U2.23 22.75,14.24 v23.5,14.99 | U3.7 v6.1,11.4 4.89,11.4 R19.2
  Bottom 0.203: v6.1,11.4 16.8,11.4 v20.77,15.37 23.11,15.37 v23.5,14.99
SCL-2  (via drill 0.8 pad 1.42)
  Top 0.203: U4.25 81.16,24.38 80.77,24.77 79.18,24.77 78.93,25.02 78.93,25.4 v78.11,26.23 | X11.SCL 78.93,28.51 78.93,27.05 v78.11,26.23 | R21.1 73.02,29.16 73.52,28.66 75.67,28.66 v78.11,26.23
SDA  (via drill 0.5, 0.8 pad 1.42)
  Top 0.203: U1.26 17.26,16.48 17.36,16.38 21.75,16.38 22.25,15.89 U2.24 22.15,13.53 v20.7,13.53 | U3.9 8.26,10.6 v7.87,10.22 5.74,10.22 5.35,9.83 5.35,8.41 R20.2
  Bottom 0.203: v20.7,13.53 17.4,10.22 v7.87,10.22 6.19,10.22 5.33,11.07 5.33,13.57 7.13,15.37 v10.73,15.37
SDA-2  (via drill 0.8 pad 1.42)
  Top 0.203: U4.26 80.66,24.11 80.51,24.26 76.85,24.26 76.05,25.06 arc-45 v75.56,26.23 74.12,27.67 R22.1
  Bottom 0.203: X11.SDA 81.41,27.43 76.77,27.43 v75.56,26.23
TX-CTRL  (via drill 0.5)
  Top 0.203: U4.47 75.93,15.8 v73.92,13.78
  Bottom 0.203: v73.92,13.78 50.93,13.78 41.85,22.86 X1.2
TX-FLIER
  Top 0.203: U1.47 21.09,24.77 22.29,24.77 22.92,25.4 X2.1
VBATT-CTRL
  Top 0.305: IC2.1 59.94,24.45 59.94,22.55 IC2.3
  Top 0.406: S1.1 64.87,31.89 C22.+ 62.2,27.93 IC2.1
VBATT-FLIER  (via drill 0.5)  (1 unrouted)
  Top 0.305: v14.29,6.87 IC1.1 | v16.19,6.87 IC1.3
  Top 1.27: M2.A@1 6.55,3.81 C1.+ 9.03,2.46 9.59,1.91 S2.P$1
  Bottom 0.203: v14.29,6.87 12.71,6.86 12.7,6.87
  Bottom 1.27: 33.02,6.87 M1.A@1 | 33.02,6.87 33.02,31.11 | 33.02,31.11 33.02,31.23 M3.B@1 | M4.B@1 29.18,34.96 33.02,31.11 | 33.02,6.87 12.7,6.87 8.67,6.87 M2.A@1
VBATT_CHG  (via drill 0.5)
  Top 0.203: X5.2 41.68,10.16 C39.+
  Top 0.305: IC4.3 50.48,6.35 v51.44,6.35
  Bottom 0.305: v51.44,6.35 47.62,10.16 X5.2
VUSB  (via drill 0.5)
  Top 0.305: IC3.4 55.56,7.75 55.3,7.49 v52.53,7.49 50.8,7.49 50.48,7.81 IC4.4 | v54.61,4.45 54.61,3.26 R9.1 54.61,3.17 | R10.1 49.53,3.26 | 49.53,3.26 v49.53,4.45 | 49.53,3.26 49.53,3.17 | C37.+ 65.39,11.96 USB.VBUS
  Top 0.406: v65.39,5.71 USB.VBUS
  Bottom 0.305: v49.53,4.45 v54.61,4.45
  Bottom 0.406: 57.78,5.71 v65.39,5.71 | 57.78,5.71 56.52,4.45 v54.61,4.45 | 57.78,5.71 56.01,7.49 v52.53,7.49
(copper drawn outside any net)
  shapes: Top area x5

### Text on the board
Top: PalmQuad | PalmQuad
tStop: PalmQuad | PalmQuad
_tsilk: OFF | ON | BAT | +V | GND | GND | GND | Wiimote Extension | SER> | SER< | <SER | MISO | MISO | MOSI | MOSI | SCK | SCK | RST | RST | Vbatt | Vbatt | +V | BAT | GND | SW